# EAGLE design leonardo32u4hvpp (EAGLE 6.3)
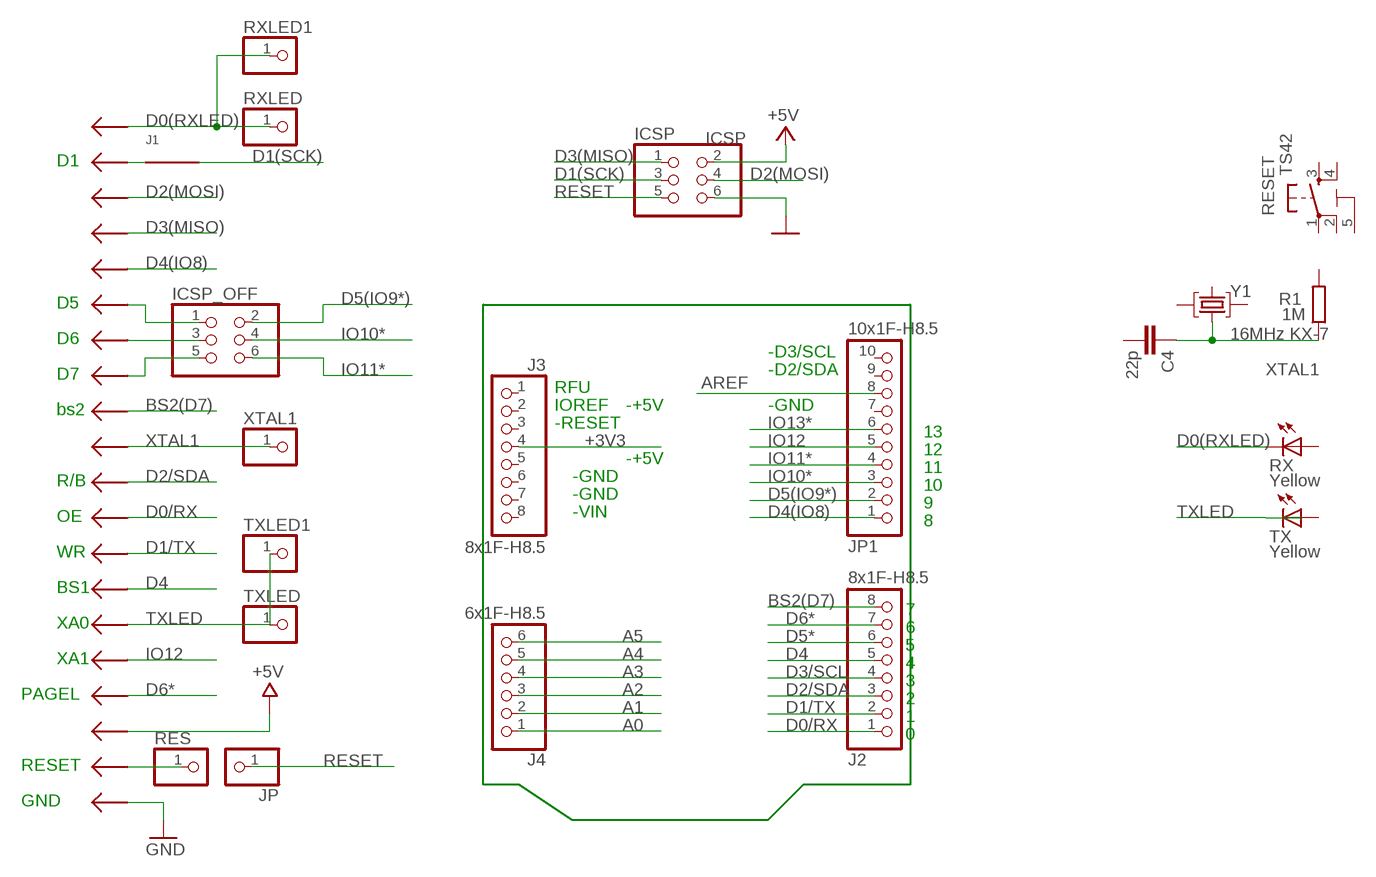
[diagram p0: schematic, sheet 1]

## Parts
C4  22p  C-EUC0603  [C0603-ROUND]
ICSP  ICSP  PINHD-2X3  [2X03]
ICSP_OFF  PINHD-2X3  [2X03]
J1  J  [R1206W]
J2  8x1F-H8.5  PINHD-1X8  [1X08]
J3  8x1F-H8.5  PINHD-1X8  [1X08]
J4  6x1F-H8.5  PINHD-1X6  [1X06]
JP  PINHD-1X1  [1X01]
JP1  10x1F-H8.5  PINHD-1X10  [1X10]
R1  1M  R-EU_R0603  [R0603-ROUND]
RES  PINHD-1X1  [1X01]
RESET  TS42  [TS42]
RX  Yellow  LEDCHIPLED_0805  [CHIPLED_0805]
RXLED  PINHD-1X1  [1X01]
RXLED1  PINHD-1X1  [1X01]
TX  Yellow  LEDCHIPLED_0805  [CHIPLED_0805]
TXLED  PINHD-1X1  [1X01]
TXLED1  PINHD-1X1  [1X01]
U$2  PROGRAMMER_P_AVR  [PROGRAMMER_P_AVR]
XTAL1  PINHD-1X1  [1X01]
Y1  16MHz KX-7  CRYSTAL-3.2-2.5  [CRYSTAL-3.2-2.5]

## Nets
+3V3: J3.4
+5V [usbvcc]: ICSP.2 U$2.VCC
A0: J4.1
A1: J4.2
A2: J4.3
A3: J4.4
A4: J4.5
A5: J4.6
AREF [aref]: JP1.8
BS2(D7): J2.8 U$2.BS2
D0(RXLED): RX.C RXLED1.1 RXLED.1 U$2.D0
D0/RX: J2.1 U$2.OE
D1(SCK): ICSP.3 J1.1
D1/TX: J2.2 U$2.WR
D2(MOSI): ICSP.4 U$2.D2
D2/SDA: J2.3 U$2.RB
D3(MISO): ICSP.1 U$2.D3
D3/SCL: J2.4
D4: J2.5 U$2.BS1
D4(IO8): JP1.1 U$2.D4
D5(IO9*): ICSP_OFF.2 JP1.2
D5*: J2.6
D6*: J2.7 U$2.PAGEL
GND [gnd]: ICSP.6 U$2.GND U$2.GND01(GND) U$2.GND2(GND) U$2.GND03(GND) U$2.GND04(GND) U$2.GND05(GND) U$2.GND06(GND) U$2.GND07(GND) U$2.GND08(GND) U$2.GND09(GND) U$2.GND10(GND) U$2.GND11(GND) U$2.GND12(GND) U$2.GND13(GND) U$2.GND14(GND) U$2.GND15(GND) U$2.GND16(GND) U$2.GND17(GND) U$2.GND18(GND) U$2.GND19(GND) U$2.GND20(GND) U$2.GND21(GND) U$2.GND22(GND)
IO10*: ICSP_OFF.4 JP1.3
IO11*: ICSP_OFF.6 JP1.4
IO12: JP1.5 U$2.XA1
IO13*: JP1.6
N$4: J1.2 U$2.D1
N$5: ICSP_OFF.5 U$2.D7
N$6: ICSP_OFF.3 U$2.D6
N$8: ICSP_OFF.1 U$2.D5
N$10: RES.1 U$2.RESET
RESET: ICSP.5 JP.1
TXLED: TX.C TXLED1.1 TXLED.1 U$2.XA0
XTAL1: C4.1 R1.1 U$2.XTAL1 XTAL1.1 Y1.1(C1)
Unconnected: C4.2 J3.1 J3.2 J3.3 J3.5 J3.6 J3.7 J3.8 JP1.7 JP1.9 JP1.10 R1.2 RESET.1 RESET.2 RESET.3 RESET.4 RX.A TX.A Y1.2(GND) Y1.3(C2) Y1.4(GND)

## Notes on the sheet
- D1
- D5
- D6
- -D3/SCL
- D7 | -D2/SDA
- RFU
- bs2 | IOREF | -+5V | -GND
- -RESET
- 13
- 12
- -+5V
- 11
- R/B | -GND
- 10
- -GND
- 9
- OE | -VIN
- 8
- WR
- BS1
- 7
- XA0 | 6
- 5
- XA1 | 4
- 3
- PAGEL | 2
- 1
- 0
- RESET
- GND

## Power pins joined to a net without a drawn wire
5-GND: RESET.5(5-GND)

## Library data of the parts
C4 = SmartPrj:C-EU: CAPACITOR, European symbol
ICSP ICSP_OFF = SmartPrj:PINHD-2X3: PIN HEADER
J1 = detali_main:J
J2 J3 = SmartPrj:PINHD-1X8: PIN HEADER
J4 = SmartPrj:PINHD-1X6: PIN HEADER
JP RES RXLED RXLED1 TXLED TXLED1 XTAL1 = pinhead:PINHD-1X1: PIN HEADER
JP1 = SmartPrj:PINHD-1X10: PIN HEADER
R1 = SmartPrj:R-EU_: RESISTOR, European symbol
RESET = SmartPrj:TS42: TS42 Dongnan Electronics Tact switch VDC 12V - 50mA
RX TX = led:LED: LED OSRAM: - CHIPLED LG R971, LG N971, LY N971, LG Q971, LY Q971, LO R971, LY R971 LH N974, LH R974 LS Q976, LO Q976, LY Q976 LO Q996 - Hyper CHIPLED LW Q18S LB Q993, LB Q99A, LB R99A - SideLED LS A670, LO A670, LY A670, LG A670, LP A670 LB A673, LV A673, LT A673, LW A673 LH A674 LY A675 LS A676, LA A676, LO A676, LY A676, LW A676 LS A679, LY A679, LG A679 - Hyper Micro SIDELED® LS Y876, LA Y876, LO Y876, LY Y876 LT Y87S - SmartLED LW L88C, LW L88S LB L89C, LB L89S, LG L890 LS L89K, LO L89K, LY L89K LS L896, LA L896, LO L896, LY L896 - TOPLED LS T670, LO T670, LY T670, LG T670, LP T670 LSG T670, LSP T670, LSY T670, LOP T670, LYG T670 LG T671, LOG T671, LSG T671 LB T673, LV T673, LT T673, LW T673 LH T674 LS T676, LA T676, LO T676, LY T676, LB T676, LH T676, LSB T676, LW T676 LB T67C, LV T67C, LT T67C, LS T67K, LO T67K, LY T67K, LW E67C LS E67B, LA E67B, LO E67B, LY E67B, LB E67C, LV E67C, LT E67C LW T67C LS T679, LY T679, LG T679 LS T770, LO T770, LY T770, LG T770, LP T770 LB T773, LV T773, LT T773, LW T773 LH T774 LS E675, LA E675, LY E675, LS T675 LS T776, LA T776, LO T776, LY T776, LB T776 LHGB T686 LT T68C, LB T68C - Hyper Mini TOPLED® LB M676 - Mini TOPLED Santana® LG M470 LS M47K, LO M47K, LY M47K Source: http://www.osram.convergy.de LUXEON: - LUMILED® LXK2-PW12-R00, LXK2-PW12-S00, LXK2-PW14-U00, LXK2-PW14-V00 LXK2-PM12-R00, LXK2-PM12-S00, LXK2-PM14-U00 LXK2-PE12-Q00, LXK2-PE12-R00, LXK2-PE12-S00, LXK2-PE14-T00, LXK2-PE14-U00 LXK2-PB12-K00, LXK2-PB12-L00, LXK2-PB12-M00, LXK2-PB14-N00, LXK2-PB14-P00, LXK2-PB14-Q00 LXK2-PR12-L00, LXK2-PR12-M00, LXK2-PR14-Q00, LXK2-PR14-R00 LXK2-PD12-Q00, LXK2-PD12-R00, LXK2-PD12-S00 LXK2-PH12-R00, LXK2-PH12-S00 LXK2-PL12-P00, LXK2-PL12-Q00, LXK2-PL12-R00 Source: www.luxeon.com KINGBRIGHT: KA-3528ASYC Source: www.kingbright.com
U$2 = AdapterDIP_P:PROGRAMMER_P_AVR
Y1 = SmartPrj:CRYSTAL-3.2-2.5

## Net classes
1 power: width 0.254 mm, drill 0.61 mm, clearance 0.254 mm
2 gnd: width 0.254 mm, drill 0.61 mm, clearance 0.254 mm
3 usbvcc: width 0.254 mm, drill 0.61 mm, clearance 0.254 mm
4 aref: width 0.254 mm, drill 0.61 mm, clearance 0.254 mm

## Board
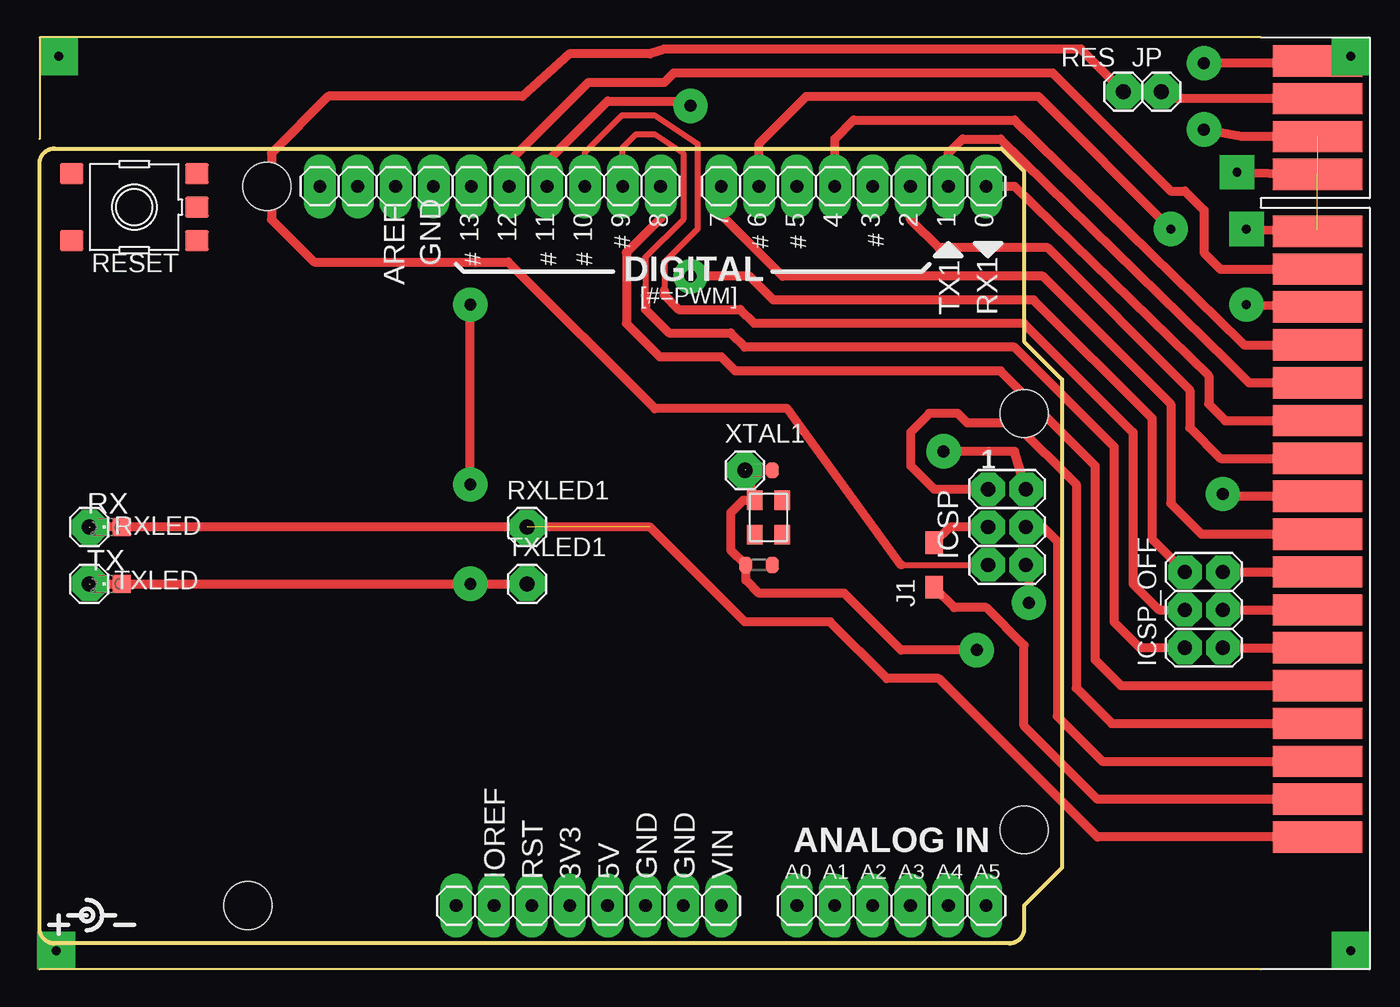
[diagram p1: board, top side]
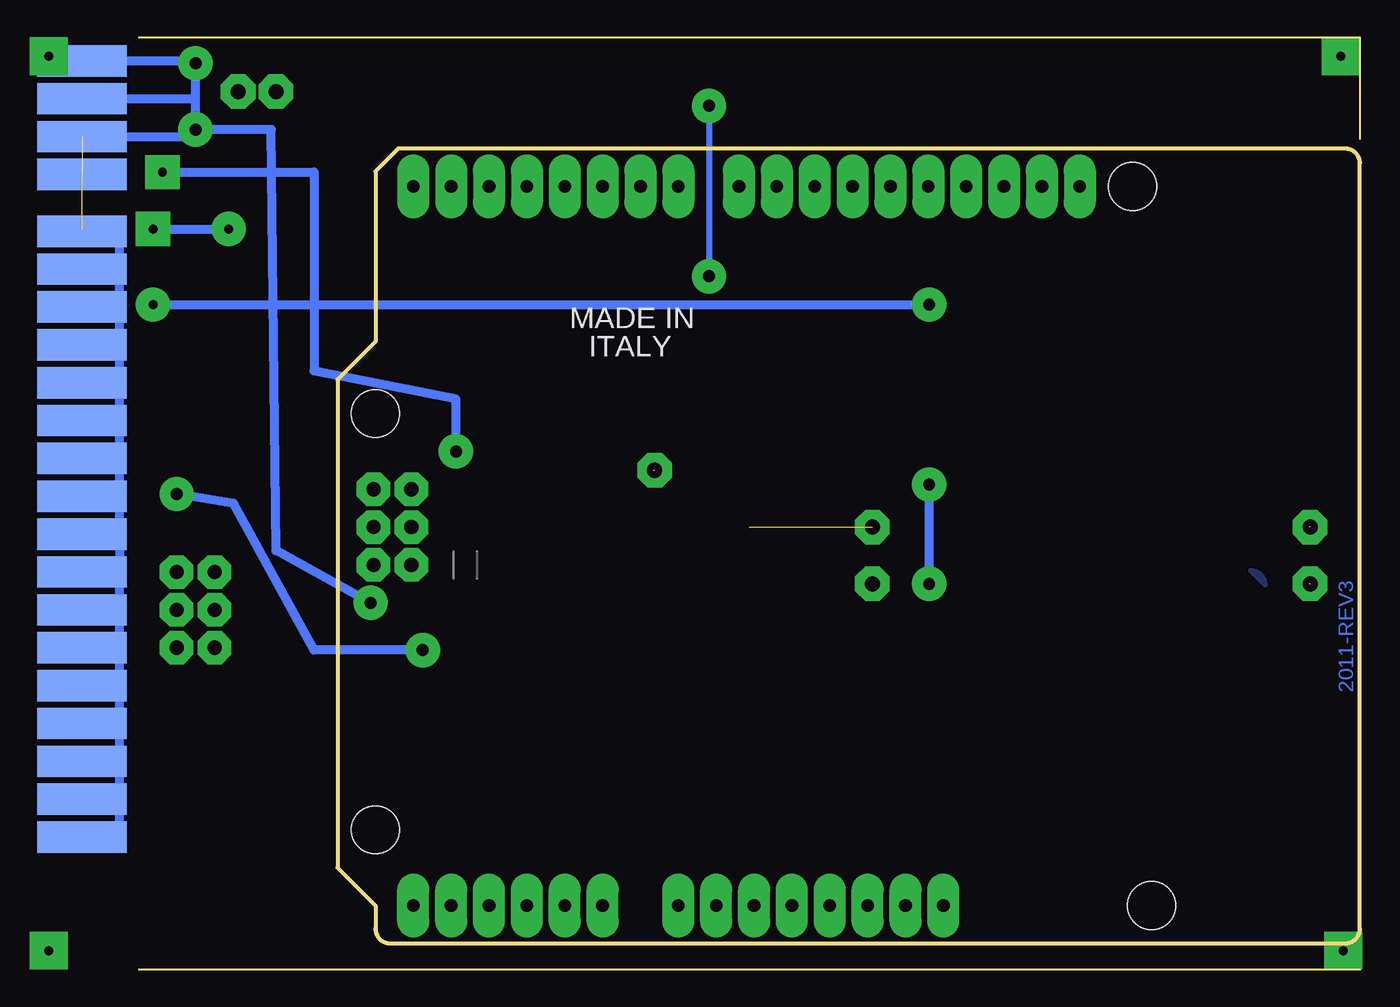
[diagram p2: board, bottom side, seen from below]

Size 81.91 x 62.55 mm. Coordinates in mm from the lower left corner, seen from the top.
Outline: 81.91,62.55 0,62.55 0,55.72
Outline: 81.91,0 0,0
Outline: 64.52,55.09 66.04,53.56 66.04,42.13 68.58,39.59 68.58,6.83 66.04,4.29 66.04,2.75 arc-90 65.04,1.75 1,1.75 arc-90 0,2.75 0,54.09 arc-90 1,55.09 64.52,55.09
Copper layers (1*16): Top 0.035mm / dielectric 1.5mm / Bottom 0.035mm
Design rules "DesignRules": minimum track width 8mil, minimum drill 24mil, track to track 0.2mm, track to pad 0.2mm, pad to pad 8mil, via to via 8mil, smd to smd 8mil, copper to edge 10mil, drill to drill 8mil, minimum pad ring 0.65mm, minimum via ring 8mil, stop-mask expansion 4mil, vias tented up to drill 0mil, thermal gap 10mil
Holes 3.2 mm at 66.04,37.31 66.04,9.37 15.24,52.55 13.97,4.29
vRestrict: area 41,37.2 to 41.5,37.4; area 34.2,33.8 to 34.9,34.3; area 42.9,33.8 to 43.6,34.3; area 39.7,33.8 to 40.2,34.3; area 46.3,8.9 to 46.9,9.4; area 48.8,8.7 to 49.3,9.6

### Footprints (pad centres in the part's own frame; a part is rotated, then mirrored left to right if it is on the bottom)
C0603-ROUND = smd 0.898 x 1.1: 1 -0.889,0; 2 0.889,0
2X03 = drill 0.95 pad 1.55 octagon: 1 -2.54,-1.27; 2 -2.54,1.27; 3 0,-1.27; 4 0,1.27; 5 2.54,-1.27; 6 2.54,1.27
R1206W = smd 1.5 x 1.2 bottom: 1 1.499,0; 2 -1.499,0
1X08 = drill 0.85 pad 1.422 long: 1 -8.89,0; 2 -6.35,0; 3 -3.81,0; 4 -1.27,0; 5 1.27,0; 6 3.81,0; 7 6.35,0; 8 8.89,0
1X06 = drill 0.85 pad 1.422 long: 1 -6.35,0; 2 -3.81,0; 3 -1.27,0; 4 1.27,0; 5 3.81,0; 6 6.35,0
1X01 = drill 1.016 octagon: 1 0,0
1X10 = drill 0.85 pad 1.422 long: 1 -11.43,0; 2 -8.89,0; 3 -6.35,0; 4 -3.81,0; 5 -1.27,0; 6 1.27,0; 7 3.81,0; 8 6.35,0; 9 8.89,0; 10 11.43,0
R0603-ROUND = smd 0.898 x 1.1: 1 -0.889,0; 2 0.889,0
TS42 = smd 1.6 x 1.4: 1 -4.2,2.25; 2 4.2,2.25; 3 -4.2,-2.25; 4 4.2,-2.25; 5 -4.2,0
CHIPLED_0805 = smd 1.2 x 1.2: A 0,-1.05; C 0,1.05
PROGRAMMER_P_AVR = smd 2.1 x 6: BS1 37.782,-0.318; BS2 25.082,-0.318; D0 4.763,-0.318; D1 7.303,-0.318; D2 9.842,-0.318; D3 12.383,-0.318; D4 14.922,-0.318; D5 17.462,-0.318; D6 20.003,-0.318; D7 22.543,-0.318; GND 51.752,-0.318; GND2 56.833,-0.318; OE 32.703,-0.318; PAGEL 45.403,-0.318; RB 30.163,-0.318; RESET 54.292,-0.318; VCC 49.212,-0.318; WR 35.242,-0.318; XA0 40.322,-0.318; XA1 42.862,-0.318; XTAL1 27.622,-0.318 | smd 2.1 x 6 bottom: GND01 4.763,-0.318; GND03 7.303,-0.318; GND04 9.842,-0.318; GND05 12.383,-0.318; GND06 14.922,-0.318; GND07 17.462,-0.318; GND08 20.003,-0.318; GND09 22.543,-0.318; GND10 25.082,-0.318; GND11 27.622,-0.318; GND12 30.163,-0.318; GND13 32.703,-0.318; GND14 35.242,-0.318; GND15 37.782,-0.318; GND16 40.322,-0.318; GND17 42.862,-0.318; GND18 45.403,-0.318; GND19 49.212,-0.318; GND20 51.752,-0.318; GND21 54.292,-0.318; GND22 56.833,-0.318
CRYSTAL-3.2-2.5 = smd 1.3 x 1.05: 1 -1.15,-0.925; 2 1.15,-0.925; 3 1.15,0.925; 4 -1.15,0.925

### Placement (x,y rotation side)
C4  48.26,33.5 0 top
ICSP  64.9,29.69 270 top
ICSP_OFF  78.1,24.13 90 top
J1  60.01,27.15 90 bottom
J2  54.61,52.55 180 top
J3  36.83,4.29 0 top
J4  57.15,4.29 0 top
JP  72.71,58.9 0 top
JP1  30.23,52.55 180 top
R1  48.26,27.15 0 top
RES  75.25,58.9 0 top
RESET  6.35,51.15 180 top
RX  4.45,29.69 90 top
RXLED  3.33,29.69 0 top
RXLED1  32.7,29.69 0 top
TX  4.45,25.88 90 top
TXLED  3.33,25.88 0 top
TXLED1  32.7,25.88 0 top
U$2  85.41,4.13 90 top  (outside the outline)
XTAL1  47.31,33.5 0 top
Y1  48.9,30.32 270 top

### Tracks (layer width: path | path; a pad name or v marks a point on that pad's centre or on a via)
+5V  (via drill 0.6 pad 2.3, 0.8 pad 2.3)
  Top 0.61: v80.33,53.5 U$2.VCC | ICSP.2 65.41,34.77 v60.64,34.77
  Bottom 0.61: v80.33,53.5 70.17,53.5 70.17,40.16 60.64,38.26 v60.64,34.77
  pour Bottom (isolate 0.406, no thermals): 6.35,25.77 arc-90 7.35,26.77
BS2(D7)
  Top 0.61: U$2.BS2 77.95,29.21 75.88,31.27 75.88,37.94 67.31,46.51 49.85,46.51 45.72,50.64 J2.8
D0(RXLED)  (2 unrouted)
  Top 0.61: RX.C 40.96,29.69 47.31,23.34 53.02,23.34 56.83,19.53 60.33,19.53 70.96,8.89 U$2.D0
D0/RX
  Top 0.61: J2.1 65.41,52.55 78.42,39.85 78.42,37.94 79.53,36.83 U$2.OE
D1(SCK)
  Top 0.61: ICSP.3 61.05,29.69 J1.1
D1/TX
  Top 0.61: J2.2 60.96,54.77 61.91,55.72 64.45,55.72 79.69,40.8 81.12,39.37 U$2.WR
D2(MOSI)
  Top 0.61: ICSP.4 67.31,29.69 68.26,28.73 68.26,16.99 71.28,13.97 U$2.D2
D2/SDA
  Top 0.61: U$2.RB 79.22,34.29 77.15,36.35 77.15,38.89 67.63,48.42 60.33,48.42 58.42,50.32 J2.3
D3(MISO)
  Top 0.61: U$2.D3 71.91,16.51 69.53,18.89 69.53,32.54 65.41,36.67 62.23,36.67 61.59,37.31 59.69,37.31 58.42,36.04 58.42,33.81 60.01,32.23 ICSP.1
D4
  Top 0.61: J2.5 53.34,55.72 54.61,56.99 65.41,56.99 80.65,42.07 80.8,41.91 U$2.BS1
D4(IO8)
  Top 0.61: JP1.1 41.66,50.39 39.37,48.1 39.37,43.34 41.59,41.12 45.72,41.12 46.67,40.16 64.45,40.16 70.8,33.81 70.8,20.8 72.55,19.05 U$2.D4
D5(IO9*)
  Top 0.406: JP1.2 39.12,55.15 40.01,56.04 41.27,56.04 43.18,54.77 43.18,50.32 40.64,47.78 40.64,45.24
  Top 0.61: 40.64,45.24 40.64,44.29 42.23,42.7 46.36,42.7 47.31,41.75 65.41,41.75 72.07,35.08 72.07,23.34 73.82,21.59 ICSP_OFF.2
D6*  (via drill 0.6 pad 2.3)
  Top 0.61: J2.7 48.26,55.4 51.44,58.58 66.99,58.58 v75.88,49.69 | v80.96,49.69 U$2.PAGEL
  Bottom 0.61: v80.96,49.69 v75.88,49.69
GND  (via drill 0.8 pad 2.3)  (2 unrouted)
  Top 0.61: U$2.GND2 85.57,60.8 v78.1,60.8 | U$2.GND20 80.65,55.88 v78.1,56.36 | ICSP.6 66.36,27.15 v66.36,24.61
  Bottom 0.61: v78.1,56.36 78.1,58.26 | 78.1,58.26 v78.1,60.8 78.26,60.96 U$2.GND2 | U$2.GND21 78.26,58.42 78.1,58.26 | U$2.GND20 78.58,55.88 v78.1,56.36 | U$2.GND01 83.18,8.89 83.18,11.43 | 83.18,11.43 83.18,13.97 | 83.18,13.97 83.18,16.51 | 83.18,16.51 83.18,19.05 | 83.18,19.05 83.18,21.59 | 83.18,21.59 83.18,24.13 | 83.18,24.13 83.18,26.67 | 83.18,29.21 83.18,31.75 | 83.18,31.75 83.18,34.29 | 83.18,34.29 83.18,36.83 | 83.18,36.83 83.18,39.37 | 83.18,39.37 83.18,41.91 | 83.18,41.91 83.18,44.45 | 83.18,44.45 83.18,46.99 | 83.18,46.99 83.18,49.69 85.72,49.69 U$2.GND18 | U$2.GND17 83.18,46.99 | U$2.GND16 83.18,44.45 | U$2.GND15 83.18,41.91 | U$2.GND14 83.18,39.37 | U$2.GND13 83.18,36.83 | U$2.GND12 83.18,34.29 | U$2.GND11 83.18,31.75 | U$2.GND10 83.18,29.21 | 83.18,29.21 83.18,26.67 | U$2.GND09 83.18,26.67 | U$2.GND08 83.18,24.13 | U$2.GND07 83.18,21.59 | U$2.GND06 83.18,19.05 | U$2.GND05 83.18,16.51 | U$2.GND04 83.18,13.97 | U$2.GND03 83.18,11.43 | v66.36,24.61 72.71,28.1 73.02,56.36 v78.1,56.36
IO10*
  Top 0.406: JP1.3 36.58,54.83 39.05,57.31 41.27,57.31 44.13,55.4 44.13,49.69 41.91,47.47 41.91,45.56
  Top 0.61: 41.91,45.56 41.91,45.24 42.86,44.29 46.99,44.29 47.94,43.34 66.04,43.34 73.34,36.04 73.34,25.88 75.09,24.13 ICSP_OFF.4
IO11*  (via drill 0.8 pad 2.3)
  Top 0.61: JP1.4 34.04,54.2 38.1,58.26 43.34,58.26 v43.66,57.94 | 43.66,46.36 v43.66,46.51 47.62,46.51 49.21,44.93 66.68,44.93 74.61,36.99 74.61,28.89 ICSP_OFF.6
  Bottom 0.406: v43.66,57.94 v43.66,46.51
IO12
  Top 0.61: JP1.5 31.5,54.2 36.83,59.53 41.91,59.53 42.55,60.17 67.94,60.17 75.88,52.23 76.83,52.23 78.1,50.96 78.1,48.1 79.22,46.99 U$2.XA1
N$1  (via drill 0.6 pad 2.54)
  other vias: 87.95,1.27
N$2  (via drill 0.6 pad 2.54)
  other vias: 87.95,61.28
N$3  (via drill 0.6 pad 2.54)
  other vias: 1.11,1.27
N$4
  Top 0.61: U$2.D1 70.96,11.43 66.04,16.35 66.04,21.75 63.5,24.29 61.37,24.29 J1.2
N$5
  Top 0.61: ICSP_OFF.5 U$2.D7
N$6
  Top 0.61: ICSP_OFF.3 U$2.D6
N$8
  Top 0.61: ICSP_OFF.1 U$2.D5
N$9  (via drill 0.6 pad 2.54)
  other vias: 1.27,61.28
N$10
  Top 0.61: U$2.RESET 75.72,58.42 RES.1
RESET
  Top 0.406: 57.79,27.15 ICSP.5
  Top 0.61: 57.79,27.15 50.16,37.62 41.27,37.62 31.43,47.47 18.42,47.47 15.56,50.32 15.56,54.77 19.37,58.58 32.38,58.58 35.56,61.44 40.96,61.44 41.91,61.75 69.85,61.75 JP.1
TXLED  (via drill 0.6 pad 2.3, 0.8 pad 2.3)  (1 unrouted)
  Top 0.61: v80.96,44.61 U$2.XA0 | TXLED.1 v28.89,25.88 TXLED1.1 | v28.89,32.54 v28.89,44.61
  Bottom 0.61: v80.96,44.61 v28.89,44.61 | v28.89,25.88 v28.89,32.54
XTAL1  (via drill 0.8 pad 2.3)  (1 unrouted)
  Top 0.61: U$2.XTAL1 79.53,31.75 v79.38,31.91 | C4.1 Y1.1 47.19,31.47 46.36,30.64 46.36,28.16 R1.1 47.37,26.13 48.26,25.24 53.97,25.24 57.79,21.43 v62.87,21.43
  Bottom 0.61: v62.87,21.43 70.17,21.43 75.57,31.27 v79.38,31.91

### Text on the board
Bottom: 2011-REV3
tPlace: 13 | 12 | 11 | 10 | 9 | 8 | 7 | 6 | 5 | 4 | 3 | 2 | 1 | 0
tNames: # | # | # | # | GND | # | # | # | DIGITAL | AREF | [#=PWM] | TX1 | RX1 | 1 | ANALOG IN | 5V | GND | GND | VIN | A0 | A1 | A2 | A3 | A4 | A5 | IOREF | RST | 3V3
bNames: MADE IN | ITALY
ReferenceLC: X2